# Altium project Apollo_FPC_Main_To_ES.PrjPcb
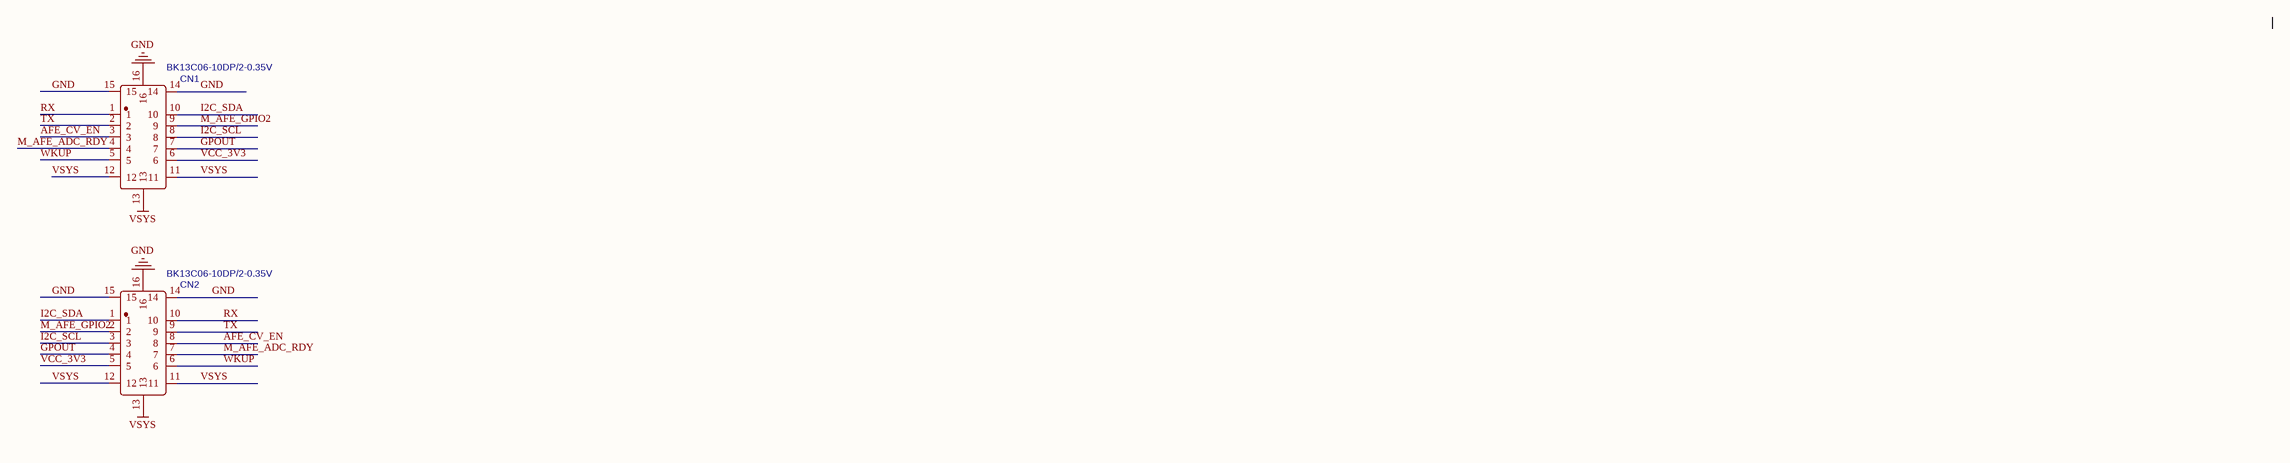
[diagram p0: FPC_MAIN_TO_ES.SchDoc]
1 sheet, 2 parts. Net scope: global (net labels, ports and power ports of the same name join across sheets).
Board file: FPC_MAIN_TO_ES.PcbDoc

## Sheet FPC_MAIN_TO_ES.SchDoc
size A2; SheetNumber: 1; SheetTotal: 1

### Parts
CN1  BK13C06-10DP/2-0.35V  [CONN-SMD_10P-P0.35_BK13C06-10DP]
CN2  BK13C06-10DP/2-0.35V  [CONN-SMD_10P-P0.35_BK13C06-10DP]

### Nets
GND: CN1.14 CN1.15 CN1.16 CN2.14 CN2.15 CN2.16
VSYS: CN1.11 CN1.12 CN1.13 CN2.11 CN2.12 CN2.13
AFE_CV_EN: CN1.3 CN2.8
GPOUT: CN1.7 CN2.4
I2C_SCL: CN1.8 CN2.3
I2C_SDA: CN1.10 CN2.1
M_AFE_ADC_RDY: CN1.4 CN2.7
M_AFE_GPIO2: CN1.9 CN2.2
RX: CN1.1 CN2.10
TX: CN1.2 CN2.9
VCC_3V3: CN1.6 CN2.5
WKUP: CN1.5 CN2.6

### Library data of the parts
CN1 CN2 = 10pin_dp_BK13C06-10DP/2-0.35V: Manufacturer: null; Contributor: lcsc; Supplier: LCSC; Supplier Part: C3040902; Manufacturer Part: BK13C06-10DP/2-0.35V; JLCPCB Part Class: Extended Part; spicePre: C; spiceSymbolName: BK13C06-10DP/2-0.35V